# Altium schematic sheet 1166V10-2.SchDoc: Half-Bridge Phase 1
size A3; Author: M. Kutzsche; Organization: Kübrich Ing.-Gesellschaft; Address1: mbH & Co. KG; Address2: Weißmühle 10; Address3: D-96170 Priesendorf; DocumentNumber: UltraZohm; Revision: 10; SheetNumber: 2; SheetTotal: 5
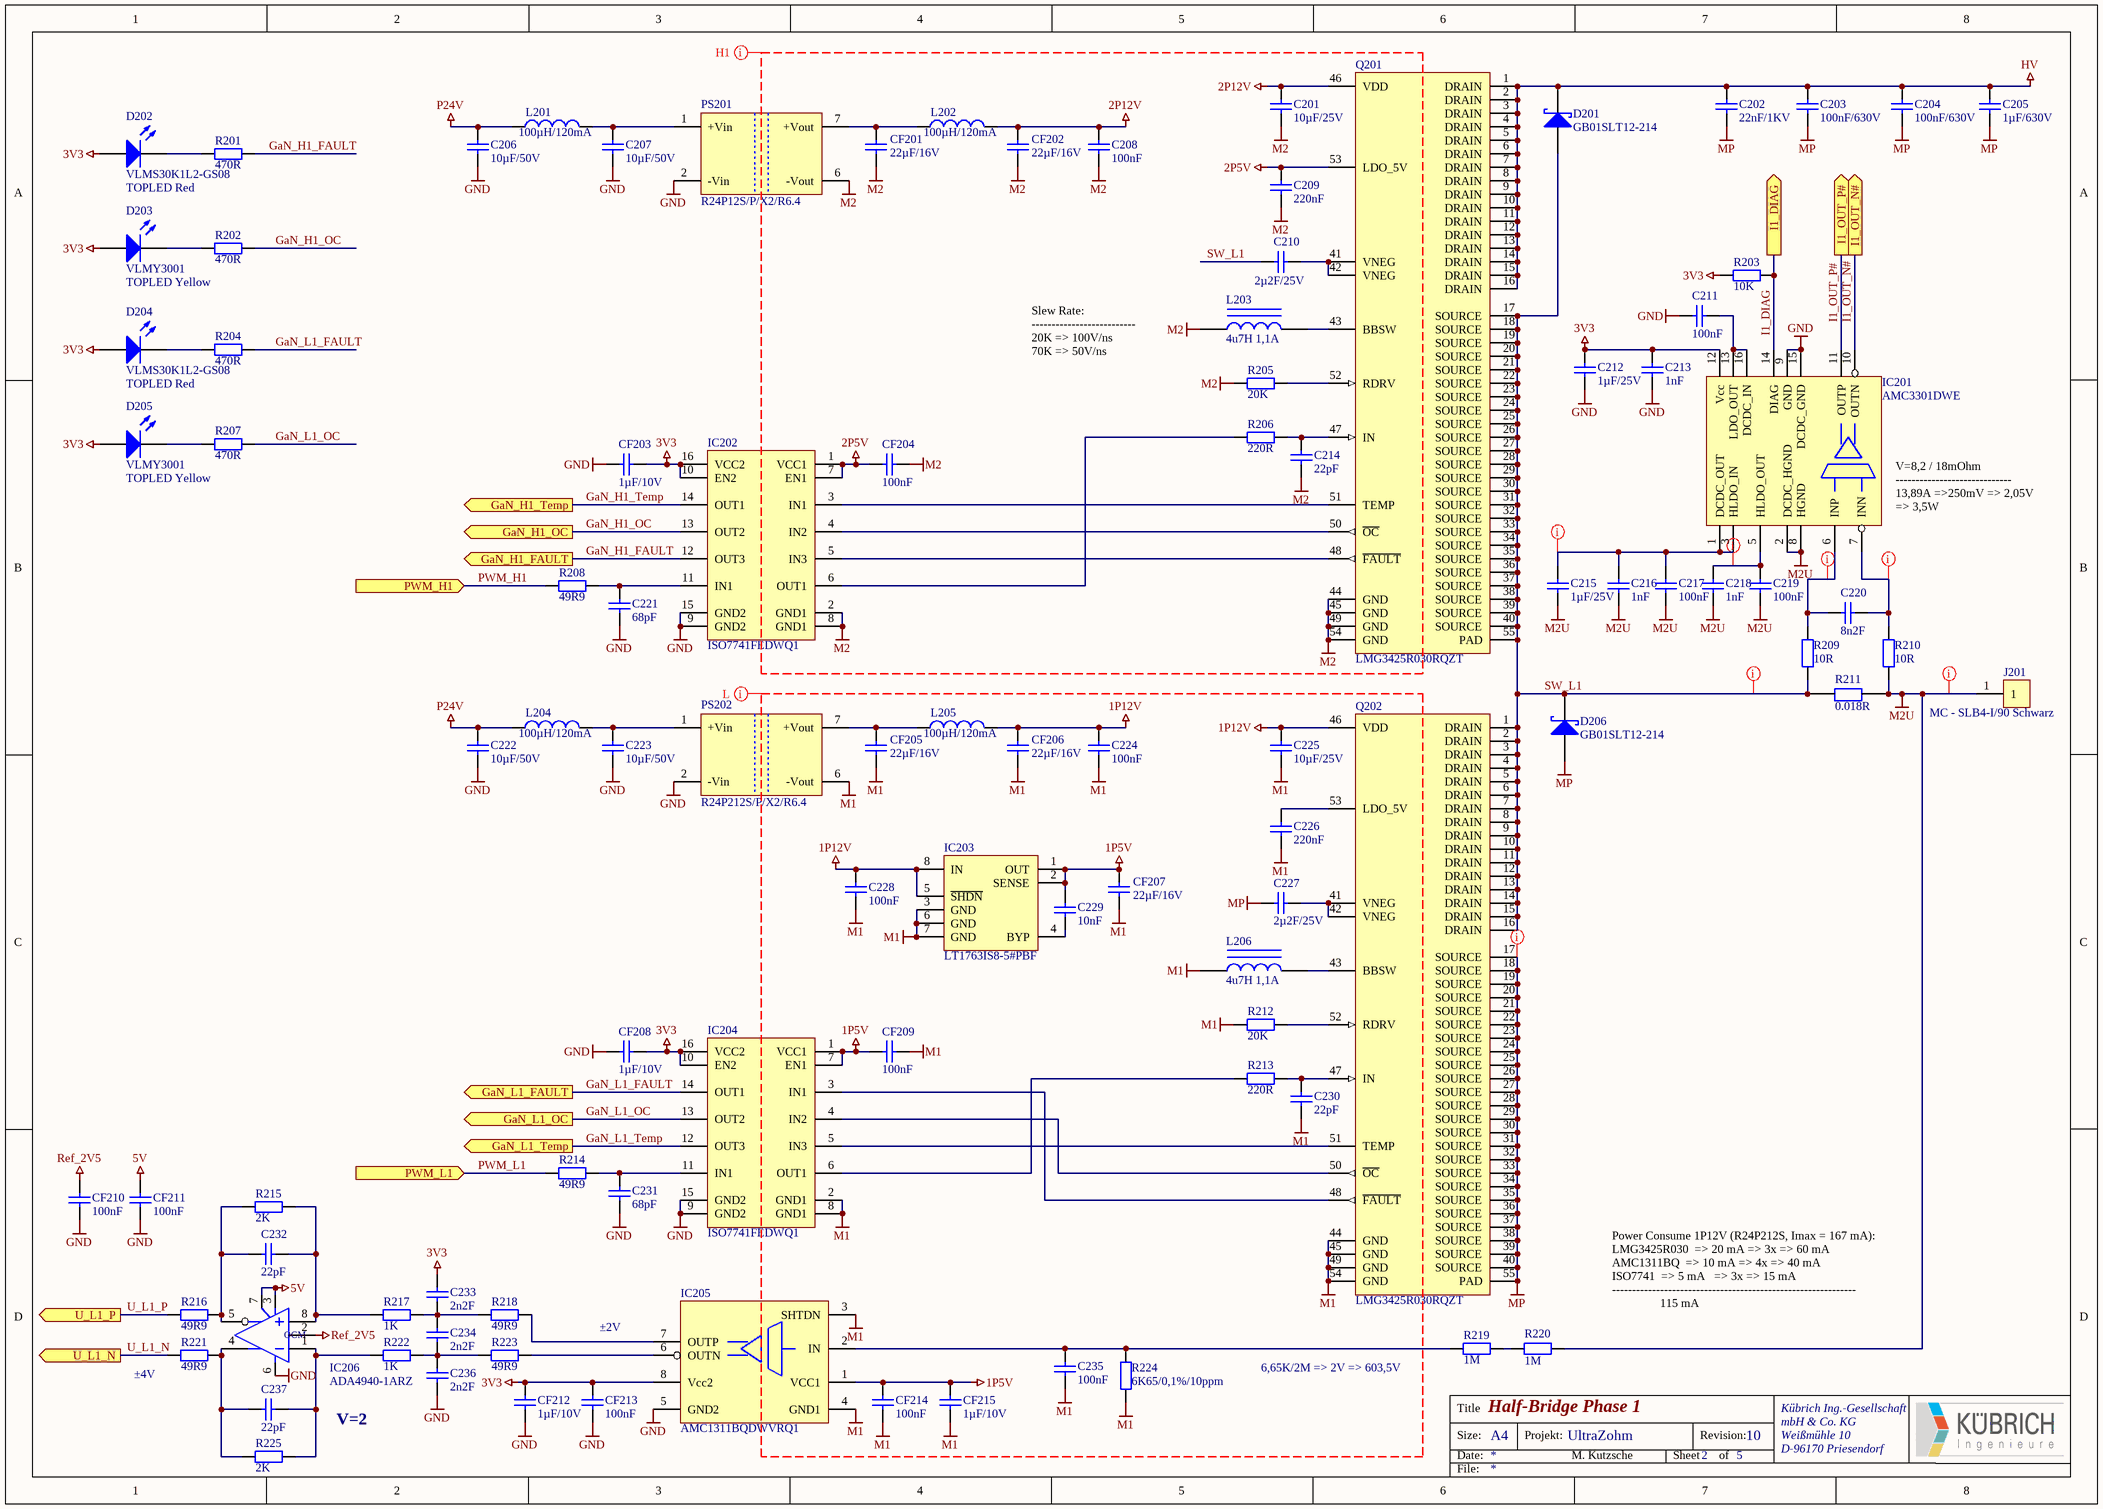
[diagram p0: 1166V10-2.SchDoc]

## Parts
C201  10µF/25V  [0805-Cap]
C202  22nF/1KV  [2220-Cap]
C203  100nF/630V  [2220-Cap]
C204  100nF/630V  [2220-Cap]
C205  1µF/630V  [2220-Cap]
C206  10µF/50V  [1206-Cap]
C207  10µF/50V  [1206-Cap]
C208  100nF  [0603-Cap]
C209  220nF  [0603-Cap]
C210  2µ2F/25V  [0805-Cap]
C211  100nF  [0603-Cap]
C212  1µF/25V  [1206-Cap]
C213  1nF  [1206-Cap]
C214  22pF  [0603-Cap]
C215  1µF/25V  [0603-Cap]
C216  1nF  [0603-Cap]
C217  100nF  [0603-Cap]
C218  1nF  [1206-Cap]
C219  100nF  [1206-Cap]
C220  8n2F  [0603-Cap]
C221  68pF  [0603-Cap]
C222  10µF/50V  [1206-Cap]
C223  10µF/50V  [1206-Cap]
C224  100nF  [0603-Cap]
C225  10µF/25V  [0805-Cap]
C226  220nF  [0603-Cap]
C227  2µ2F/25V  [0805-Cap]
C228  100nF  [0603-Cap]
C229  10nF  [0603-Cap]
C230  22pF  [0603-Cap]
C231  68pF  [0603-Cap]
C232  22pF  [0603-Cap]
C233  2n2F  [0603-Cap]
C234  2n2F  [0603-Cap]
C235  100nF  [0603-Cap]
C236  2n2F  [0603-Cap]
C237  22pF  [0603-Cap]
CF201  22µF/16V  [0805-Cap]
CF202  22µF/16V  [0805-Cap]
CF203  1µF/10V  [0603-Cap]
CF204  100nF  [0603-Cap]
CF205  22µF/16V  [0805-Cap]
CF206  22µF/16V  [0805-Cap]
CF207  22µF/16V  [0805-Cap]
CF208  1µF/10V  [0603-Cap]
CF209  100nF  [0603-Cap]
CF210  100nF  [0603-Cap]
CF211  100nF  [0603-Cap]
CF212  1µF/10V  [0603-Cap]
CF213  100nF  [0603-Cap]
CF214  100nF  [0603-Cap]
CF215  1µF/10V  [0603-Cap]
D201  GB01SLT12-214  [DO-214 (SMB)]
D202  VLMS30K1L2-GS08  Class II: TOPLED Red  [PLCC-2_rot]
D203  VLMY3001  Class II: TOPLED Yellow  [PLCC-2_gelb]
D204  VLMS30K1L2-GS08  Class II: TOPLED Red  [PLCC-2_rot]
D205  VLMY3001  Class II: TOPLED Yellow  [PLCC-2_gelb]
D206  GB01SLT12-214  [DO-214 (SMB)]
IC201  AMC3301DWE  [SOIC-16-W - 8.1mm]
IC202  ISO7741FEDWQ1  [SOIC-16-W - 8.1mm]
IC203  LT1763IS8-5#PBF  [SOIC-8-N]
IC204  ISO7741FEDWQ1  [SOIC-16-W - 8.1mm]
IC205  AMC1311BQDWVRQ1  [SOIC-8-W]
IC206  ADA4940-1ARZ  [SOIC-8-N]
J201  MC - SLB4-I/90 Schwarz  [SLB4-I/90 - 4mm]
L201  100µH/120mA  [1007-IND (2518)]
L202  100µH/120mA  [1007-IND (2518)]
L203  4u7H 1,1A  [2.0mm x 1.6mm]
L204  100µH/120mA  [1007-IND (2518)]
L205  100µH/120mA  [1007-IND (2518)]
L206  4u7H 1,1A  [2.0mm x 1.6mm]
PS201  R24P12S/P/X2/R6.4  [SIP-7 Single - X2]
PS202  R24P212S/P/X2/R6.4  [SIP-7 Single - X2]
Q201  LMG3425R030RQZT  [VQFN-54 (RQZ0054)]
Q202  LMG3425R030RQZT  [VQFN-54 (RQZ0054)]
R201  470R  [0603-Res]
R202  470R  [0603-Res]
R203  10K  [0603-Res]
R204  470R  [0603-Res]
R205  20K  [0603-Res]
R206  220R  [0603-Res]
R207  470R  [0603-Res]
R208  49R9  [0603-Res]
R209  10R  [0603-Res]
R210  10R  [0603-Res]
R211  0.018R  [2512]
R212  20K  [0603-Res]
R213  220R  [0603-Res]
R214  49R9  [0603-Res]
R215  2K  [0603-Res]
R216  49R9  [0603-Res]
R217  1K  [0603-Res]
R218  49R9  [0603-Res]
R219  1M  [2512-Res]
R220  1M  [2512-Res]
R221  49R9  [0603-Res]
R222  1K  [0603-Res]
R223  49R9  [0603-Res]
R224  6K65/0,1%/10ppm  [0603-Res]
R225  2K  [0603-Res]

## Ports
GaN_H1_FAULT (out), GaN_H1_OC (out), GaN_H1_Temp (out), GaN_L1_FAULT (out), GaN_L1_OC (out), GaN_L1_Temp (out), I1_DIAG (out), I1_OUT_N# (out), I1_OUT_P# (out), PWM_H1 (in), PWM_L1 (in), U_L1_N (out), U_L1_P (out)

## Nets
1P5V: C229.1 CF207.1 CF209.2 CF214.1 CF215.1 IC203.1(OUT) IC203.2(SENSE) IC204.1(VCC1) IC204.7(EN1) IC205.1(VCC1)
1P12V: C224.1 C225.2 C228.1 CF206.1 IC203.5(~{SHDN}) IC203.8(IN) L205.2 Q202.46(VDD)
2P5V: C209.2 CF204.2 IC202.1(VCC1) IC202.7(EN1) Q201.53(LDO_5V)
2P12V: C201.2 C208.1 CF202.1 L202.2 Q201.46(VDD)
3V3: C212.1 C213.1 C233.2 CF203.1 CF208.1 CF212.1 CF213.1 D202.1(A) D203.1(A) D204.1(A) D205.1(A) IC201.12(Vcc) IC202.10(EN2) IC202.16(VCC2) IC204.10(EN2) IC204.16(VCC2) IC205.8(Vcc2) R203.2
5V: CF211.1 IC206.3(V+) IC206.7(EN)
GND: C206.1 C207.1 C211.1 C212.2 C213.2 C221.1 C222.1 C223.1 C231.1 C236.1 CF203.2 CF208.2 CF210.2 CF211.2 CF212.2 CF213.2 IC201.9(GND) IC201.15(DCDC_GND) IC202.9(GND2) IC202.15(GND2) IC204.9(GND2) IC204.15(GND2) IC205.5(GND2) IC206.6(V-) PS201.2(-Vin) PS202.2(-Vin)
HV: C202.1 C203.1 C204.1 C205.1 D201.2(K) Q201.1(DRAIN) Q201.2(DRAIN) Q201.3(DRAIN) Q201.4(DRAIN) Q201.5(DRAIN) Q201.6(DRAIN) Q201.7(DRAIN) Q201.8(DRAIN) Q201.9(DRAIN) Q201.10(DRAIN) Q201.11(DRAIN) Q201.12(DRAIN) Q201.13(DRAIN) Q201.14(DRAIN) Q201.15(DRAIN) Q201.16(DRAIN)
M1: C224.2 C225.1 C226.1 C228.2 C230.1 C235.1 CF205.2 CF206.2 CF207.2 CF209.1 CF214.2 CF215.2 IC203.3(GND) IC203.6(GND) IC203.7(GND) IC204.2(GND1) IC204.8(GND1) IC205.3(SHTDN) IC205.4(GND1) L206.1 PS202.6(-Vout) Q202.44(GND) Q202.45(GND) Q202.49(GND) Q202.54(GND) R212.2 R224.2
M2: C201.1 C208.2 C209.1 C214.1 CF201.2 CF202.2 CF204.1 IC202.2(GND1) IC202.8(GND1) L203.1 PS201.6(-Vout) Q201.44(GND) Q201.45(GND) Q201.49(GND) Q201.54(GND) R205.2
M2U: C215.2 C216.2 C217.2 C218.2 C219.2 IC201.2(DCDC_HGND) IC201.8(HGND) J201.1 R210.1 R211.2 R220.2
MP: C202.2 C203.2 C204.2 C205.2 C227.2 D206.1(A) Q202.17(SOURCE) Q202.18(SOURCE) Q202.19(SOURCE) Q202.20(SOURCE) Q202.21(SOURCE) Q202.22(SOURCE) Q202.23(SOURCE) Q202.24(SOURCE) Q202.25(SOURCE) Q202.26(SOURCE) Q202.27(SOURCE) Q202.28(SOURCE) Q202.29(SOURCE) Q202.30(SOURCE) Q202.31(SOURCE) Q202.32(SOURCE) Q202.33(SOURCE) Q202.34(SOURCE) Q202.35(SOURCE) Q202.36(SOURCE) Q202.37(SOURCE) Q202.38(SOURCE) Q202.39(SOURCE) Q202.40(SOURCE) Q202.55(PAD)
P24V: C206.2 C222.2 L201.1 L204.1
Ref_2V5: CF210.1 IC206.2(OCM)
GaN_H1_FAULT: IC202.12(OUT3) R201.2 ; port GaN_H1_FAULT
GaN_H1_OC: IC202.13(OUT2) R202.2 ; port GaN_H1_OC
GaN_H1_Temp: IC202.14(OUT1) ; port GaN_H1_Temp
GaN_L1_FAULT: IC204.14(OUT1) R204.2 ; port GaN_L1_FAULT
GaN_L1_OC: IC204.13(OUT2) R207.2 ; port GaN_L1_OC
GaN_L1_Temp: IC204.12(OUT3) ; port GaN_L1_Temp
I1_DIAG: IC201.14(DIAG) R203.1 ; port I1_DIAG
I1_OUT_N#: IC201.10(OUTN) ; port I1_OUT_N#
I1_OUT_P#: IC201.11(OUTP) ; port I1_OUT_P#
PWM_H1: R208.2 ; port PWM_H1
PWM_L1: R214.2 ; port PWM_L1
SW_L1: C210.1 D201.1(A) D206.2(K) Q201.17(SOURCE) Q201.18(SOURCE) Q201.19(SOURCE) Q201.20(SOURCE) Q201.21(SOURCE) Q201.22(SOURCE) Q201.23(SOURCE) Q201.24(SOURCE) Q201.25(SOURCE) Q201.26(SOURCE) Q201.27(SOURCE) Q201.28(SOURCE) Q201.29(SOURCE) Q201.30(SOURCE) Q201.31(SOURCE) Q201.32(SOURCE) Q201.33(SOURCE) Q201.34(SOURCE) Q201.35(SOURCE) Q201.36(SOURCE) Q201.37(SOURCE) Q201.38(SOURCE) Q201.39(SOURCE) Q201.40(SOURCE) Q201.55(PAD) Q202.1(DRAIN) Q202.2(DRAIN) Q202.3(DRAIN) Q202.4(DRAIN) Q202.5(DRAIN) Q202.6(DRAIN) Q202.7(DRAIN) Q202.8(DRAIN) Q202.9(DRAIN) Q202.10(DRAIN) Q202.11(DRAIN) Q202.12(DRAIN) Q202.13(DRAIN) Q202.14(DRAIN) Q202.15(DRAIN) Q202.16(DRAIN) R209.1 R211.1
U_L1_N: R221.2 ; port U_L1_N
U_L1_P: R216.2 ; port U_L1_P
NetC207_2: C207.2 L201.2 PS201.1(+Vin)
NetC210_2: C210.2 Q201.41(VNEG) Q201.42(VNEG)
NetC211_2: C211.2 IC201.13(LDO_OUT) IC201.16(DCDC_IN)
NetC214_2: C214.2 Q201.47(IN) R206.1
NetC215_1: C215.1 C216.1 C217.1 IC201.1(DCDC_OUT) IC201.3(HLDO_IN)
NetC218_1: C218.1 C219.1 IC201.5(HLDO_OUT)
NetC220_1: C220.1 IC201.7(INN) R210.2
NetC220_2: C220.2 IC201.6(INP) R209.2
NetC221_2: C221.2 IC202.11(IN1) R208.1
NetC223_2: C223.2 L204.2 PS202.1(+Vin)
NetC226_2: C226.2 Q202.53(LDO_5V)
NetC227_1: C227.1 Q202.41(VNEG) Q202.42(VNEG)
NetC229_2: C229.2 IC203.4(BYP)
NetC230_2: C230.2 Q202.47(IN) R213.1
NetC231_2: C231.2 IC204.11(IN1) R214.1
NetC232_1: C232.1 IC206.8(+) R215.1 R217.2
NetC232_2: C232.2 IC206.5(Out) R215.2 R216.1
NetC233_1: C233.1 C234.2 R217.1 R218.2
NetC234_1: C234.1 C236.2 R222.1 R223.2
NetC235_2: C235.2 IC205.2(IN) R219.1 R224.1
NetC237_1: C237.1 IC206.1(-) R222.2 R225.1
NetC237_2: C237.2 IC206.4(Out) R221.1 R225.2
NetCF201_1: CF201.1 L202.1 PS201.7(+Vout)
NetCF205_1: CF205.1 L205.1 PS202.7(+Vout)
NetD202_2: D202.2(K) R201.1
NetD203_2: D203.2(K) R202.1
NetD204_2: D204.2(K) R204.1
NetD205_2: D205.2(K) R207.1
NetIC202_3: IC202.3(IN1) Q201.51(TEMP)
NetIC202_4: IC202.4(IN2) Q201.50(~{OC})
NetIC202_5: IC202.5(IN3) Q201.48(~{FAULT})
NetIC202_6: IC202.6(OUT1) R206.2
NetIC204_3: IC204.3(IN1) Q202.48(~{FAULT})
NetIC204_4: IC204.4(IN2) Q202.50(~{OC})
NetIC204_5: IC204.5(IN3) Q202.51(TEMP)
NetIC204_6: IC204.6(OUT1) R213.2
NetIC205_6: IC205.6(OUTN) R223.1
NetIC205_7: IC205.7(OUTP) R218.1
NetL203_2: L203.2 Q201.43(BBSW)
NetL206_2: L206.2 Q202.43(BBSW)
NetQ201_52: Q201.52(RDRV) R205.1
NetQ202_52: Q202.52(RDRV) R212.1
NetR219_2: R219.2 R220.1

## Layout directives
net class H1: 2P5V, 2P12V, M2, M2U, NetC215_1, NetC218_1, NetC220_1, NetC220_2, SW_L1
net class L: 1P5V, 1P12V, M1, MP

## Notes on the sheet
- Slew Rate:
  --------------------------
  20K => 100V/ns
  70K => 50V/ns
- (near IC201) V=8,2 / 18mOhm
  -----------------------------
  13,89A =>250mV => 2,05V
  => 3,5W
- Power Consume 1P12V (R24P212S, Imax = 167 mA):
  LMG3425R030 	=> 20 mA => 3x => 60 mA
  AMC1311BQ 	=> 10 mA => 4x => 40 mA
  ISO7741		=> 5 mA   => 3x => 15 mA
  -------------------------------------------------------------
  115 mA
- (near R221) ±4V
- ±2V
- 6,65K/2M => 2V => 603,5V
- V=2
- Title
- Size:
- Date:
- A4
- Projekt:
- Sheet
- Revision:
- of
- File:

## Library data of the parts
C201-C237 CF201-CF215 = Cap_SMD: Capacitor (SMD); Class I: Pasiv; Class II: Capacitor; Last edited: 20.11.2006 10:25
  C201 C225: value: 10µF/25V
  C202: value: 22nF/1KV
  C203 C204: value: 100nF/630V
  C205: value: 1µF/630V
  C206 C207 C222 C223: value: 10µF/50V
  C208 C211 C217 C219 C224 C228 C235 CF204 CF209-CF211 CF213 CF214: value: 100nF
  C209 C226: value: 220nF
  C210 C227: value: 2µ2F/25V
  C212 C215: value: 1µF/25V
  C213 C216 C218: value: 1nF
  C214 C230 C232 C237: value: 22pF
  C220: value: 8n2F
  C221 C231: value: 68pF
  C229: value: 10nF
  C233 C234 C236: value: 2n2F
  CF201 CF202 CF205-CF207: value: 22µF/16V
  CF203 CF208 CF212 CF215: value: 1µF/10V
D201 D206 = GB01SLT12-214: Silicon Carbide Schottky Diode Vr=1200V If=1A; Manufacturer: GeneSiC Semiconductor; Class I: Discret; Package information: Unknown; Best.-Nr.: DigiKey: 1242-1169-1-ND; Class II: Silicon Carbide Schottky Diode Vr=1200V If=1A; Datasheet: Ver. 7 Nov 2000; Package reference: DO-214AA (SMB)
D202 D204 = VLMS30K1L2-GS08: Top LED Super red, 2mA, 18mcd, -40-100°C; Manufacturer: Vishay; Class I: Discrete; Best.-Nr.: Farnell 132-8349; Last edited: 23.01.2007 08:58
D203 D205 = VLMY3001: Top LED Yellow, 2mA, 18mcd, -40-100°C; Manufacturer: Vishay; Class I: Discrete; Best.-Nr.: ???; Last edited: 23.01.2007 08:58
IC201 = AMC3301DWE: ±250 mV Input Voltage Range, Reinforced Isolated Amplifier and High Bandwidth of 300 kHz; Manufacturer: Texas Instruments; Class II: ±250 mV, 300KHz, -40-125°C; Package information: Unknown; Best.-Nr.: DigiKey: 296-AMC3301DWE-ND; Class I: Isolated Amplifier; Datasheet: Unknown; Package reference: SOIC-16-W
IC202 IC204 = ISO7741FEDWQ1: Quad-CH 100Mbps Isolators 1 IN/3 OUT, 5000V Reinforced, (-40-150°C); Manufacturer: Anaolog Devices; Class I: Optocoupler; Package information: Unknown; Best.-Nr.: DigiKey: 296-ISO7741FEDWQ1-ND; Class II: Quad-CH 100Mbps Isolators 1 IN/3 OUT, 5000V Reinforced, (-40-150°C); Datasheet: Unknown; Package reference: SOIC-16W
IC203 = LT1763IS8-5#PBF: LDO 5V/500mA, Vin 20V (-40-125°C); Manufacturer: Linear Technology; Class I: Discret; Package information: Unknown; Best.-Nr.: Farnell 229-5214; Class II: LDO 5V/500mA, Vin 20V (-40-125°C); Datasheet: ???; Package reference: SO-8
IC205 = AMC1311BQDWVRQ1: 2V Input, Automotive High-Impedance, Reinforced Isolated Amplifier for Voltage Sensing; Manufacturer: Texas Instruments; Class II: 2V, 275KHz, -40-125°C; Package information: Unknown; Best.-Nr.: Mouser: 595-AMC1311BQDWVRQ1; Class I: Isolated Amplifier; Datasheet: Unknown; Package reference: SOIC-8-W
IC206 = ADA4940-1ARZ: Fully Differential ADC Drivers (-40-125°C); Manufacturer: ANALOG DEVICES; Class I: Analog; Best.-Nr.: Farnell 209-6178; Class II: Fully Differential ADC Drivers (-40-125°C); Datasheet: DSO11449, Ver. Aug 2000; Last edited: 04.01.2007 10:14; Package Reference: SOIC-N-8
J201 = MC - SLB4-I/90 Schwarz: Labor Winkelbuchsen 4mm Schwarz; Manufacturer: Multi-Contact; Class I: Connectors; Best.-Nr.: Farnell: 108-5521; Class II: Labor Winkelbuchsen 4mm Schwarz; Last edited: 07.03.2007 13:28
L201 L202 L204 L205 = CB2518T101K: 100µH, 60/120mA. (1007), -40-105°C; Manufacturer: Taiyo Yuden; Class I: Pasive; Best.-Nr.: DigiKey:   587-2192-1-ND; Class II: 100µH, 60/120mA. (1007), -40-105°C; Last edited: 08.12.2006 12:28
L203 L206 = SDEM20161T-4R7MS: Power Choke 4u7H 1,1A; Manufacturer: Delta Electronics/Cyntec; Class I: Pasive; Best.-Nr.: DigiKey: 2037-SDEM20161T-4R7MSCT-ND; Class II: Power Choke 4u7H 1,1A; Last edited: 15.03.2007 11:19
PS201 = R24P12S/P/X2/R6.4: DC/DC Converter 24V to 12V, 1W, 84mA (unregulated) 6,4KVDC Rainforced; Manufacturer: Recom; Class I: Analog; Package information: Unknown; Best.-Nr.: Mouser: 919-R24P12SX2PR6.4; Class II: DC/DC Converter 24V to 12V, 1W, 84mA (unregulated) 6,4KVDC Rainforced; Package reference: SIP-7; Datasheet: Rev. 28 Apr 2002
PS202 = R24P212S/P/X2/R6.4: DC/DC Converter 24V to 12V, 2W, 167mA (unregulated) 6,4KVDC Rainforced; Manufacturer: Recom; Class I: Analog; Package information: Unknown; Best.-Nr.: Mouser: 919-R24P212SX2PR6.4; Class II: DC/DC Converter 24V to 12V, 2W, 167mA (unregulated) 6,4KVDC Rainforced; Package reference: SIP-7; Datasheet: Rev. 28 Apr 2002
Q201 Q202 = LMG3425R030RQZT: GaN FET Power Stage With Cycle-by-cycle Overcurrent Protection 600V/40A/30mOhm; Manufacturer: Texas Instruments; Class I: Discret; Package information: Unknown; Best.-Nr.: TI-Shop; Class II: GaN FET Power Stage With Cycle-by-cycle Overcurrent Protection 600V/40A/30mOhm; Datasheet: LMG3425R030; Package reference: VQFN-32
R201-R210 R212-R218 R221-R225 = Res_SMD: Resistor SMD; Class I: Pasiv; Class II: Resistor; Last edited: 17.11.2006 11:38
  R201 R202 R204 R207: value: 470R
  R203: value: 10K
  R205 R212: value: 20K
  R206 R213: value: 220R
  R208 R214 R216 R218 R221 R223: value: 49R9
  R209 R210: value: 10R
  R215 R225: value: 2K
  R217 R222: value: 1K
  R224: value: 6K65/0,1%/10ppm
R211 = MCLRP12DTDRR018: 18mOhm, 3W, 0,5%, 50ppm/°C; Manufacturer: Milticomp; Class I: Pasiv; Class II: Shunt 3W; Best.-Nr.: Farnell: 282-8111; Last edited: 23.11.2010 14:12; value: 0.018R
R219 R220 = HVCB2512BDE1M00: Resistor SMD 1M/0,1%/3KV/2W/25ppm/°C; Class I: Pasiv; Best.-Nr.: DigiKey: HVCB2512BDE1M00CT-ND; Class II: Resistor; Last edited: 17.11.2006 11:38; value: 1M